# Altium schematic sheet connectors.SchDoc
size A4
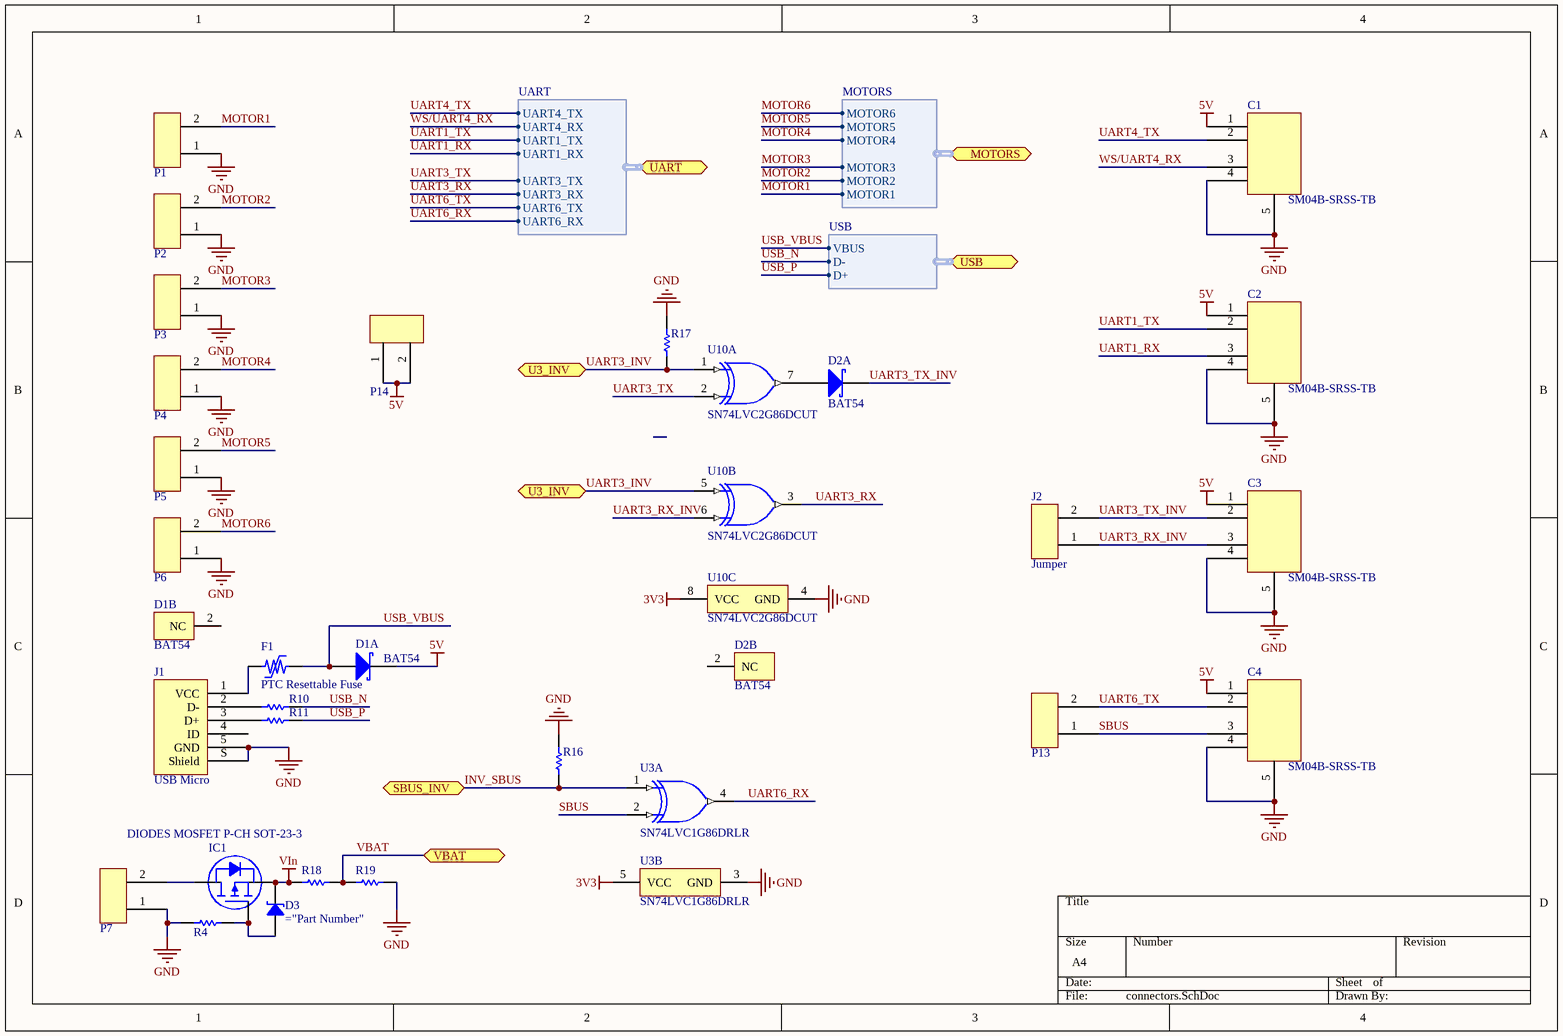
[diagram p0: connectors.SchDoc]

## Parts
C1  SM04B-SRSS-TB  [SM04B-SRSS-TB]
C2  SM04B-SRSS-TB  [SM04B-SRSS-TB]
C3  SM04B-SRSS-TB  [SM04B-SRSS-TB]
C4  SM04B-SRSS-TB  [SM04B-SRSS-TB]
D1  BAT54  [NXP-SOT23-3_V]  (parts A,B of 2)
D2  BAT54  [NXP-SOT23-3_V]  (parts A,B of 2)
D3  (no value)  [SOD-123]
F1  PTC Resettable Fuse  [F0805]
IC1  DIODES MOSFET P-CH SOT-23-3  [DIODES SOT-23-3]
J1  USB Micro  [FCI USB 10118193-0001LF]
J2  Jumper  [Jumper]
P1  2Pads  [2Pads]  (value not drawn)
P2  2Pads  [2Pads]  (value not drawn)
P3  2Pads  [2Pads]  (value not drawn)
P4  2Pads  [2Pads]  (value not drawn)
P5  2Pads  [2Pads]  (value not drawn)
P6  2Pads  [2Pads]  (value not drawn)
P7  2Pads  [2Pads]  (value not drawn)
P13  2 Pads  [2Pads]  (value not drawn)
P14  2 Pads  [2Pads]  (value not drawn)
R4  100K 5% 0402(1005)  [RESC0402(1005)_L]  (value not drawn)
R10  22R 5% 0402(1005)  [RESC0402(1005)_M]  (value not drawn)
R11  22R 5% 0402(1005)  [RESC0402(1005)_M]  (value not drawn)
R16  10K 5% 0402(1005)  [RESC0402(1005)_L]  (value not drawn)
R17  10K 5% 0402(1005)  [RESC0402(1005)_L]  (value not drawn)
R18  10K 5% 0402(1005)  [RESC0402(1005)_L]  (value not drawn)
R19  1K 5% 0402(1005)  [RESC0402(1005)_L]  (value not drawn)
U3  SN74LVC1G86DRLR  [DRL0005A_M]  (parts A,B of 2)
U10  SN74LVC2G86DCUT  [DCU0008A_M]  (parts A,B,C of 3)

## Ports
MOTORS (harness MOTORS), SBUS_INV, U3_INV, UART (harness UART), USB (harness USB), VBAT

## Harnesses
USB: VBUS, D-, D+
MOTORS: MOTOR1, MOTOR2, MOTOR3, MOTOR4, MOTOR5, MOTOR6
UART: UART4_TX, UART4_RX, UART1_TX, UART1_RX, UART3_TX, UART3_RX, UART6_TX, UART6_RX

## Nets
3V3: U3.5(VCC) U10.8(VCC)
5V: C1.1 C2.1 C3.1 C4.1 D1.3(K) P14.1 P14.2
GND: C1.4 C1.5 C2.4 C2.5 C3.4 C3.5 C4.4 C4.5 J1.5(GND) J1.S(Shield) P1.1 P2.1 P3.1 P4.1 P5.1 P6.1 P7.1 R4.1 R16.2 R17.2 R19.2 U3.3(GND) U10.4(GND)
VIn: D3.2 IC1.3(S) R18.1
INV_SBUS: R16.1 U3.1(A) ; port SBUS_INV
MOTOR1: P1.2 ; port MOTORS.MOTOR1
MOTOR2: P2.2 ; port MOTORS.MOTOR2
MOTOR3: P3.2 ; port MOTORS.MOTOR3
MOTOR4: P4.2 ; port MOTORS.MOTOR4
MOTOR5: P5.2 ; port MOTORS.MOTOR5
MOTOR6: P6.2 ; port MOTORS.MOTOR6
SBUS: C4.3 P13.1 U3.2(B)
UART1_RX: C2.3 ; port UART.UART1_RX
UART1_TX: C2.2 ; port UART.UART1_TX
UART3_INV: R17.1 U10.1(1A) U10.5(2A) ; port U3_INV
UART3_RX: U10.3(2Y) ; port UART.UART3_RX
UART3_RX_INV: C3.3 J2.1 U10.6(2B)
UART3_TX: U10.2(1B) ; port UART.UART3_TX
UART3_TX_INV: C3.2 D2.3(K) J2.2
UART4_TX: C1.2 ; port UART.UART4_TX
UART6_RX: U3.4(Y) ; port UART.UART6_RX
UART6_TX: C4.2 P13.2 ; port UART.UART6_TX
USB_N: R10.2 ; port USB.D-
USB_P: R11.2 ; port USB.D+
USB_VBUS: D1.1(A) F1.2 ; port USB.VBUS
VBAT: R18.2 R19.1 ; port VBAT
WS/UART4_RX: C1.3 ; port UART.UART4_RX
NetD2_1: D2.1(A) U10.7(1Y)
NetD3_1: D3.1 IC1.1(G) R4.2
NetF1_1: F1.1 J1.1(VCC)
NetIC1_2: IC1.2(D) P7.2
NetJ1_2: J1.2(D-) R10.1
NetJ1_3: J1.3(D+) R11.1

Not connected (* = marked no-connect by the designer): D1 2(NC); D2 2(NC); J1 4(ID)

## Library data of the parts
C1-C4 = SM04B-SRSS-TB: JST SH 4-Pin Side Entry Housing
D1 D2 = CMP-0417-00004-1: Schottky Barrier Diode, 30 V, 2 uA, -55 to 150 degC, 3-Pin SOT23, RoHS, Tape and Reel; Manufacturer: NXP Semiconductors; Cd (pF): 10; Rth(j-a) (K/W): 500; VF (mV): 800; Trr (ns): 5; IR (uA): 2; VR (V): 30; DatasheetVersion: Rev. 5; Mounting Technology: Surface Mount; Temperature Range: -55 to 150 degC; Packing: Tape and Reel; PartNumber: BAT54; ComponentLink2Description: Datasheet; PackageReference: SOT23-3; ComponentLink2URL: http://www.nxp.com/documents/data_sheet/BAT54_SER.pdf; RoHS: TRUE; ComponentLink1Description: Manufacturer URL; PackageDescription: 3-Pin Plastic Surface-mounted Package, Body 1.3 x 2.9 mm, Pitch 0.95 mm; ComponentLink1URL: http://www.nxp.com/
D3 = Diode Zener: Zener Diode
F1 = PPTC: MF-PSMF Series - PTC Resettable Fuses; Manufacturer: Bourns; Voltage Rating (DC): 6V; Max Current Rating: 100A; Power Dissipation: 800mW; Resistance: 150mOhm; Package Quantity: 2000; Voltage Rating: 6V; RoHSCompliant: true; Contact Plating: Gold; REACH SVHC: NoSVHC; Datasheet URL: http://www.bourns.com/docs/Product-Datasheets/mfmsmf.pdf; Lead Free: LeadFree; Height: 0.85mm; Min Operating Temperature: -40degC; Case Code (Metric): 4532; Number of Terminals: 2; Case Code (Imperial): 1812; Case/Package: 1812; Current Rating: 100A; Length: 4.73mm; Max Operating Temperature: 85degC; Package Reference: MF-MSMF050-2; Radiation Hardening: No; Datasheet Version: Rev. AG, 08/2016; Packaging: TapeandReel; Termination: SMD/SMT; Supply Voltage: 6V; Manufacturer URL: http://www.bourns.com/; Mount: SurfaceMount; Package Description: 2-Pin Surface Mount Device, Body 4.55 x 3.24 mm
J1 = USB 2.0 Type B Micro
J2 = PCB Jumper
R4 = CMP-1011-00122-1: 100K 0.063W 5% 0402 (1005 Metric)  SMD; Value: 100000.00 Ohm; Case-EIA: 0402; Case-Metric: 1005; Power: 0.063 W; Technology: SMT; Tolerance: 5 %
R10 R11 = CMP-1011-00034-1: 22R 0.063W 5% 0402 (1005 Metric)  SMD; Value: 22.00 Ohm; Case-EIA: 0402; Case-Metric: 1005; Power: 0.063 W; Tolerance: 5 %; Technology: SMT
R16-R18 = CMP-1011-00098-1: 10K 0.063W 5% 0402 (1005 Metric)  SMD; Case-Metric: 1005; Value: 10000.00 Ohm; Case-EIA: 0402; Technology: SMT; Tolerance: 5 %; Power: 0.063 W
R19 = CMP-1011-00074-1: 1K 0.063W 5% 0402 (1005 Metric)  SMD; Value: 1000.00 Ohm; Case-EIA: 0402; Case-Metric: 1005; Tolerance: 5 %; Power: 0.063 W; Technology: SMT
U3 = CMP-0859-00794-3: Single 2-Input Exclusive-OR Gate, DRL0005A, LARGE T&R; Manufacturer: Texas Instruments; ICC @ Nom Voltage(Max)(mA): 0.01; Sub-Family: XOR Gate; VCC(Max)(V): 5.5; Output Drive (IOL/IOH)(Max)(mA): 32/-32; Technology Family: LVC; Voltage(Nom)(V): 1.8,2.5,3.3,5; VCC(Min)(V): 1.65; 3-State Output: No; Input Type: CMOS/TTL; Bits(#): 1; tpd @ Nom Voltage(Max)(ns): 9.9,5.5,5,4; Output Type: CMOS; Logic: True; Rating: Catalog; Gate Type: XOR; F @ Nom Voltage(Max)(Mhz): 150; Operating Temperature Range(C): -40 to 125,-40 to 85; DatasheetVersion: SCES222O; Generic Part Number: SN74LVC1G86; PackageReference: DRL0005A; Schmitt Trigger: No
U10 = CMP-0859-00611-3: Dual 2-Input Exclusive-Or Gate, DCU0008A, SMALL T&R; Manufacturer: Texas Instruments; Technology Family: LVC; Bits(#): 2; Voltage(Nom)(V): 1.8,2.5,3.3,5; VCC(Min)(V): 1.65; Schmitt Trigger: No; VCC(Max)(V): 5.5; Sub-Family: XOR Gate; Input Type: CMOS/TTL; Output Drive (IOL/IOH)(Max)(mA): 32/-32; F @ Nom Voltage(Max)(Mhz): 150; Rating: Catalog; ICC @ Nom Voltage(Max)(mA): 0.01; Logic: True; Output Type: CMOS; tpd @ Nom Voltage(Max)(ns): 11,6.7,5.6,4.2; PackageReference: DCU0008A; Generic Part Number: SN74LVC2G86; 3-State Output: No; DatasheetVersion: SCES360I; Operating Temperature Range(C): -40 to 125,-40 to 85